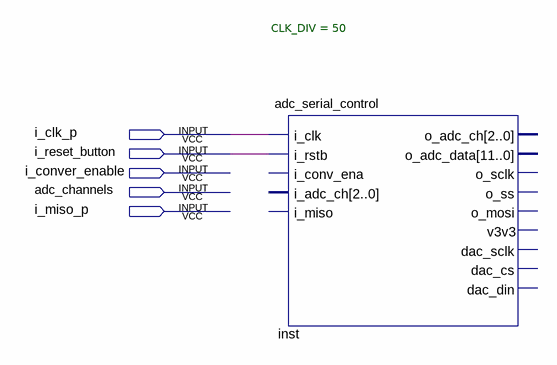
[diagram p0: schematic sheet]
// Quartus schematic Block2.bdf as structural Verilog: 1 symbols, 5 pins
module Block2 (
  input  i_clk_p,
  input  i_reset_button,
  input  i_conver_enable,
  input  adc_channels,
  input  i_miso_p
);

  adc_serial_control #(.CLK_DIV(50)) inst (
    .i_clk(i_clk_p), .i_rstb(i_reset_button));  // open: i_conv_ena, i_adc_ch, i_miso, o_adc_ch, o_adc_data, o_sclk, o_ss, o_mosi, v3v3, dac_sclk, dac_cs, dac_din
endmodule
